# Altium schematic sheet logic_perif.SchDoc: mcHF Pro Transceiver UI board
size A3; Author: Krassi Atanassov; CompanyName: MØNKA; Engineer: For radio amateurs experimentation, non-commercial use only. Thank you!; Revision: 0.8.2; SheetTotal: 18
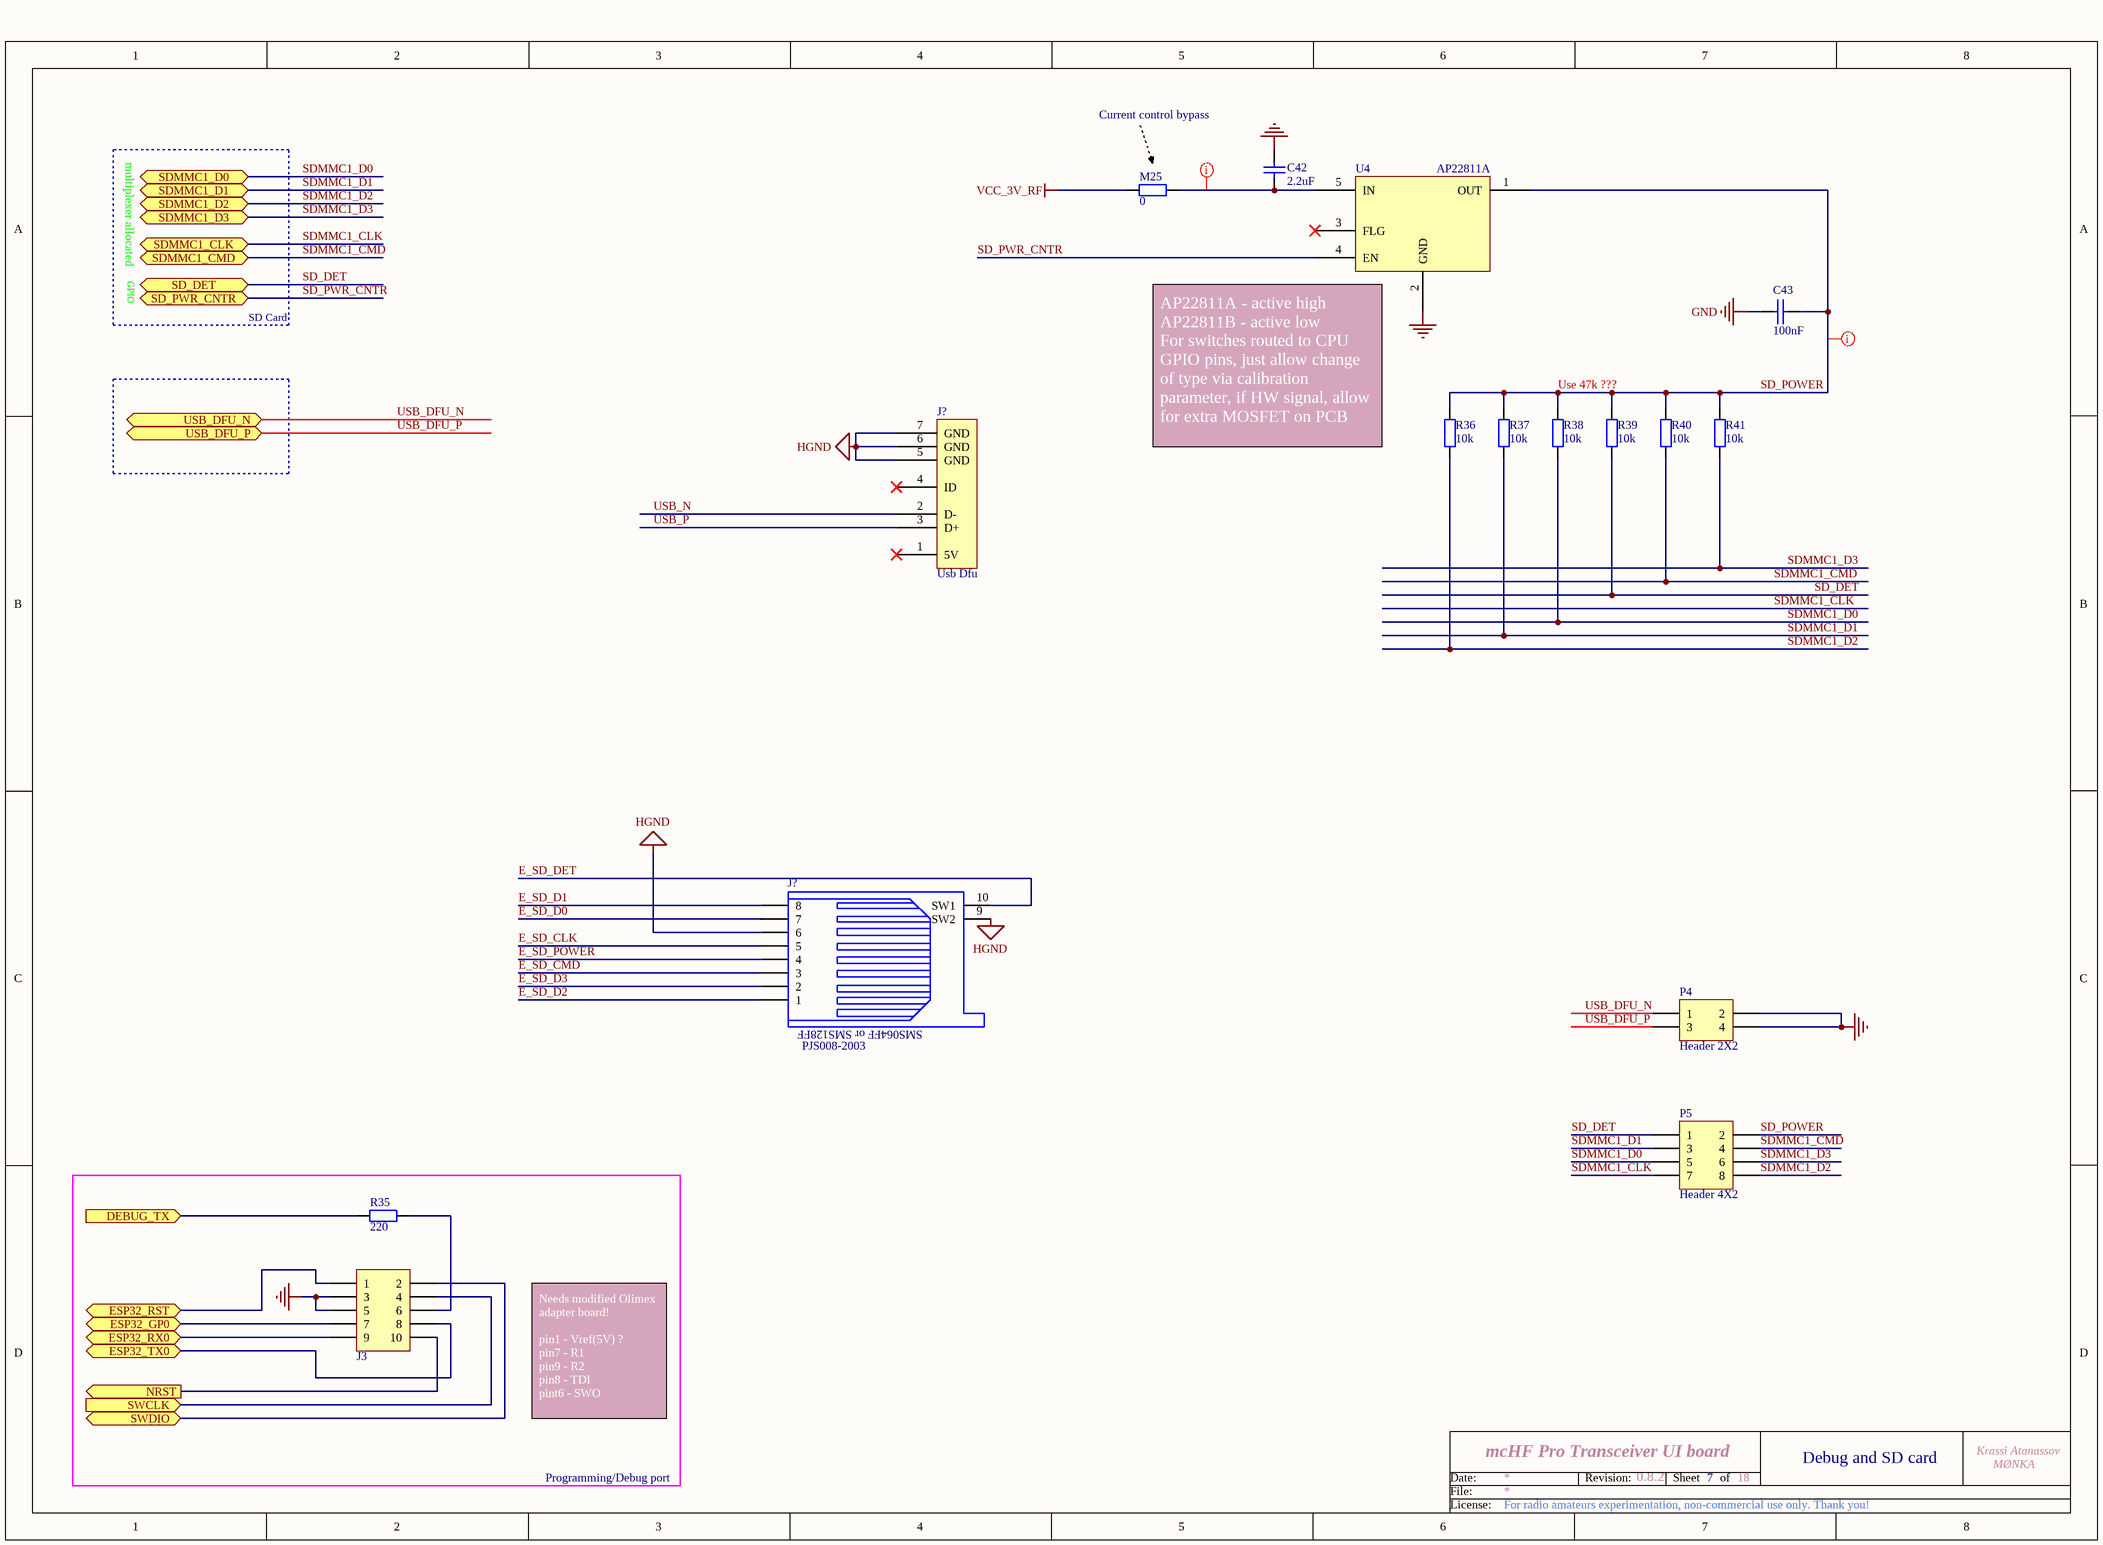
[diagram p0: logic_perif.SchDoc]

## Parts
(Parts that share a designator on the sheet are numbered #1, #2 ... from top to bottom, then left to right.)
C42  2.2uF  [0805]
C43  100nF  [0805]
J3  FTSH-105-01-L-DV-K  [JTAG10]  (value not drawn)
J?#1  Usb Dfu  [MINI_USB_B_SMD]
J?#2  PJS008-2003  [PJS008-2003-1]
M25  0  [0805]
P4  Header 2X2  [HDR2X2]
P5  Header 4X2  [HDR2X4]
R35  220  [0805]
R36  10k  [0805]
R37  10k  [0805]
R38  10k  [0805]
R39  10k  [0805]
R40  10k  [0805]
R41  10k  [0805]
U4  AP22811A  [SOT25-5]

## Blocks framed on the sheet
Programming/Debug port: J3 R35

## Ports
DEBUG_TX (in), ESP32_GP0 (bidir), ESP32_RST (bidir), ESP32_RX0 (bidir), ESP32_TX0 (bidir), NRST (out), SD_DET (bidir), SD_PWR_CNTR (bidir), SDMMC1_CLK (bidir), SDMMC1_CMD (bidir), SDMMC1_D0 (bidir), SDMMC1_D1 (bidir), SDMMC1_D2 (bidir), SDMMC1_D3 (bidir), SWCLK (in), SWDIO (bidir), USB_DFU_N (bidir), USB_DFU_P (bidir)

## Nets
GND: C42.1 C43.2 J3.3 J3.5 P4.2 P4.4 U4.2(GND)
HGND: J?#1.5(GND) J?#1.6(GND) J?#1.7(GND) J?#2.6 J?#2.9(SW2)
VCC_3V_RF: M25.1
DEBUG_TX: R35.2 ; port DEBUG_TX
E_SD_CLK: J?#2.5
E_SD_CMD: J?#2.3
E_SD_D0: J?#2.7
E_SD_D1: J?#2.8
E_SD_D2: J?#2.1
E_SD_D3: J?#2.2
E_SD_DET: J?#2.10(SW1)
E_SD_POWER: J?#2.4
ESP32_GP0: J3.7 ; port ESP32_GP0
ESP32_RST: J3.1 ; port ESP32_RST
ESP32_RX0: J3.9 ; port ESP32_RX0
ESP32_TX0: J3.8 ; port ESP32_TX0
NRST: J3.10 ; port NRST
SD_DET: P5.1 R39.2 ; port SD_DET
SD_POWER: C43.1 P5.2 R36.1 R37.1 R38.1 R39.1 R40.1 R41.1 U4.1(OUT)
SD_PWR_CNTR: U4.4(EN) ; port SD_PWR_CNTR
SDMMC1_CLK: P5.7 ; port SDMMC1_CLK
SDMMC1_CMD: P5.4 R40.2 ; port SDMMC1_CMD
SDMMC1_D0: P5.5 R38.2 ; port SDMMC1_D0
SDMMC1_D1: P5.3 R37.2 ; port SDMMC1_D1
SDMMC1_D2: P5.8 R36.2 ; port SDMMC1_D2
SDMMC1_D3: P5.6 R41.2 ; port SDMMC1_D3
SWCLK: J3.4 ; port SWCLK
SWDIO: J3.2 ; port SWDIO
USB_DFU_N: P4.1 ; port USB_DFU_N
USB_DFU_P: P4.3 ; port USB_DFU_P
USB_N: J?#1.2(D-)
USB_P: J?#1.3(D+)
NetC42_2: C42.2 M25.2 U4.5(IN)
NetJ3_6: J3.6 R35.1

Not connected (* = marked no-connect by the designer): J?#1 1(5V)* 4(ID)*; U4 3(FLG)*

## Layout directives
rule Width Constraint [Pref Width = 12mil    Min Width = 12mil    Max Width = 12mil]: NetC42_2, SD_POWER

## Notes on the sheet
- Current control bypass
- multiplexer allocated
- GPIO
- SD Card
- Use 47k ???
- (near U4) AP22811A - active high                                 AP22811B - active low                             For switches routed to CPU GPIO pins, just allow change of type via calibration parameter, if HW signal, allow for extra MOSFET on PCB
- (near J?#2) SMS064FF or SMS128FF
- Needs modified Olimex adapter board!
  pin1 - Vref(5V) ?
  pin7 - R1
  pin9 - R2
  pin8 - TDI
  pint6 - SWO
- 7
- Debug and SD card
- Date:
- File:
- Revision:
- Sheet
- of
- License:

## Library data of the parts
C42 = CAP SMD 0603  X5R 1礔 25V 10%: 0603  X5R 1礔; Rated voltage: 25V; Tolerance: 10%; Manufacturer: *; Manufacturer P/N: *; Order code Farnell: 1288202RL; Value: 1礔; Power: *; Technology: X5R; Temperature  Factor: *; Temperature Max: +125癈; Temperature Min: -55癈; STS Code: *
C43 = CAP: Capacitor; Order: FN 282-1264; QT Order: QCC-00157; Price: 0.089
J3 = JTAG10: Header 5x2, 1.27mm, Dual row, Straight, SMD; Internal_Part_Number: MCD-00592; Manufacturer_Part_Number: FTSH-107-01-L-DV-009-ES-A; Manufacturer: SAMTEC; Part_Type: Connector; Provided_By: Subcon; Initial_Board_Reference: mb1331; Notes: mini 10pin JTAG connector/NOT FOR MASS PRODUCTION!; Status: Symbol available; ComponentLink1Description: Samtec_ftsh_smt.pdf; ComponentLink1URL: http://tunmcdsvn.tun.st.com/Component_Datasheet_Library/Trunk/Connectors/Samtec_ftsh_smt.pdf
J?#1 = MINI_USB_B: Mini USB connector; Order: FN 211-2367; QT Order: QCJ-00083; Price: 0.62
J?#2 = microSD-PJS008-2003: Memory Card Connectors MicroSD Card Conn Revrs Mnt Push-Push; Manuf_1: YAMAICHI; Notes: need to find on Ali!; Manuf_Part_1: PJS008-2003-1; Distrib: *; Order: PJS008-2003-1; ECCN_US/EU: n/a
M25 = RES: Resistor; Order: FN 933-3681; QT Order: QCR-00268; Price: 0.009
P4 = Header 2X2: Header, 2-Pin, Dual row; LatestRevisionDate: 17-Jul-2002; LatestRevisionNote: Re-released for DXP Platform.; Publisher: Altium Limited
P5 = Header 4X2: Header, 4-Pin, Dual row; LatestRevisionDate: 17-Jul-2002; LatestRevisionNote: Re-released for DXP Platform.; Publisher: Altium Limited
R35 = RES: Resistor; Order: FN 146-9899; QT Order: QCR-00309; Price: 0.023
R36 = RES: Resistor; Order: FN 146-9857; QT Order: QCR-00349; QT Price: 0.03; Price: 0.046
R37-R41 = RES: Resistor; Order: FN 146-9857; Price: 0.046
U4 = AP22811: High-side switch; Order: FN 274-8550